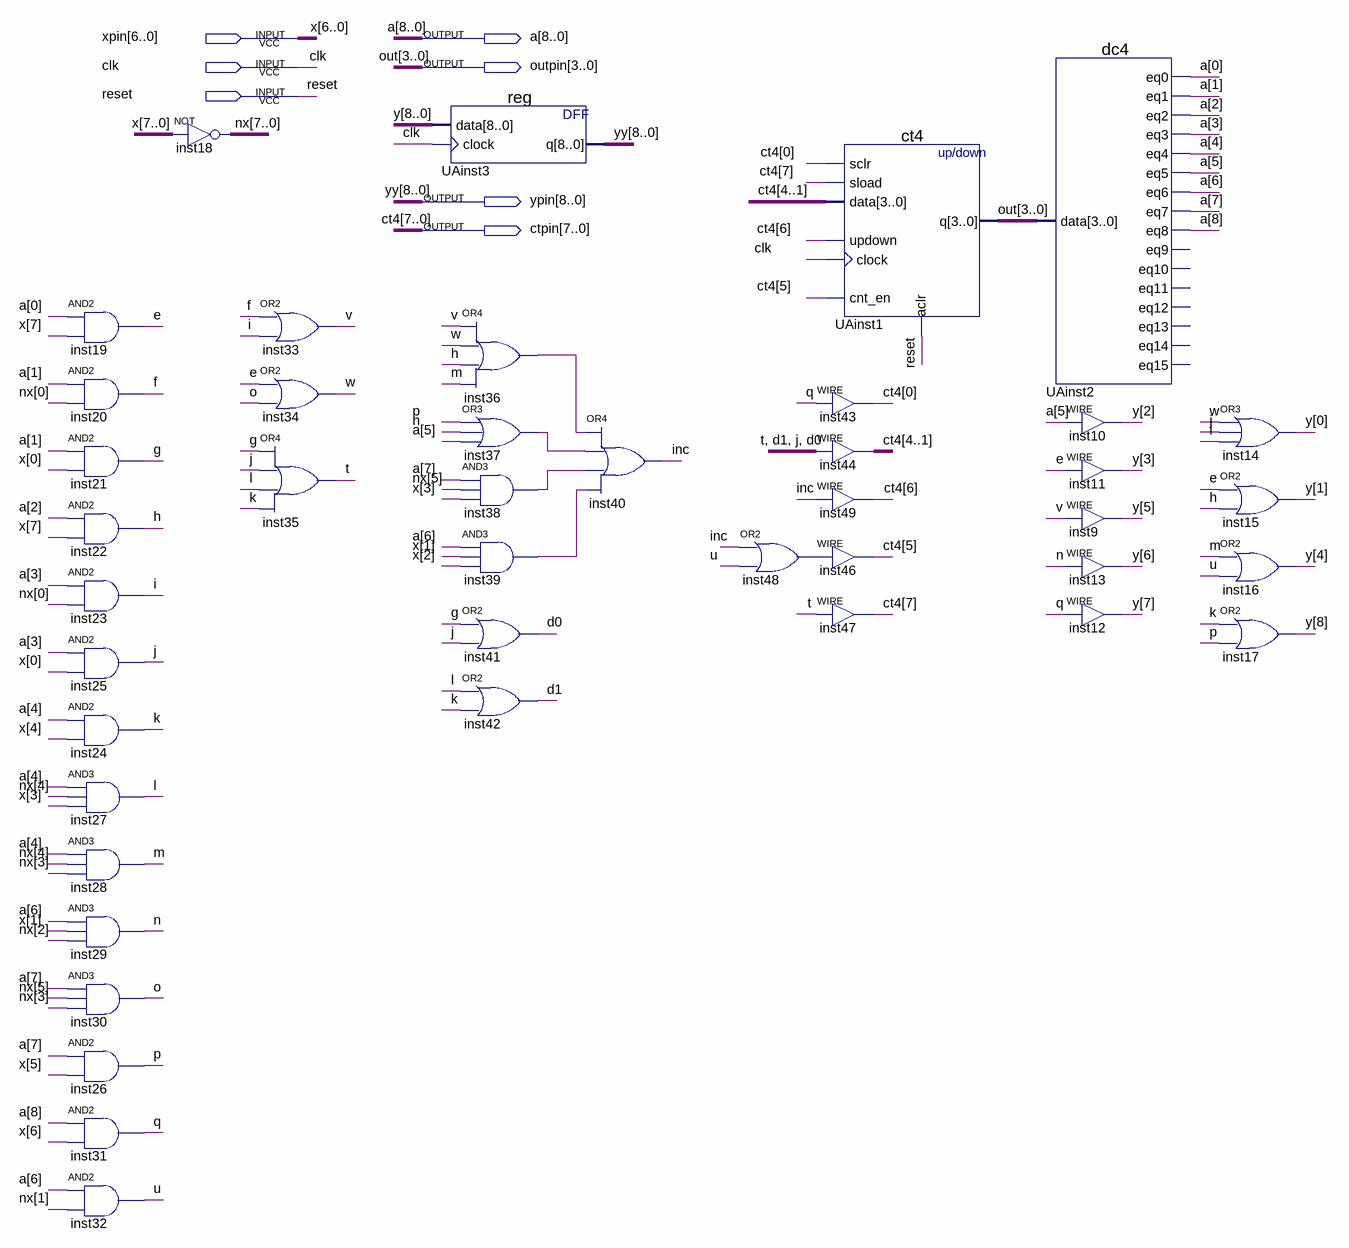
[diagram p0: schematic sheet]
// Quartus schematic UA.bdf as structural Verilog: 43 symbols, 7 pins
module UA (
  input  [6:0] xpin,
  input  clk,
  input  reset,
  output [8:0] a,
  output [3:0] outpin,
  output [8:0] ypin,
  output [7:0] ctpin
);

  wire d0, d1, e, f, g, h, i, inc, inst36_out, inst37_out, inst38_out, inst39_out, inst48_out, j, k, l, m, n,
       o, p, q, t, u, v, w;
  wire [7:0] nx;
  wire [7:7] x;
  wire [8:0] y;

  and inst19 (e, a[0], x[7]);
  and inst20 (f, a[1], nx[0]);
  and inst21 (g, a[1], xpin[0]);
  and inst22 (h, a[2], x[7]);
  and inst23 (i, a[3], nx[0]);
  and inst25 (j, a[3], xpin[0]);
  and inst24 (k, a[4], xpin[4]);
  and inst27 (l, a[4], nx[4], xpin[3]);
  and inst28 (m, a[4], nx[4], nx[3]);
  and inst29 (n, a[6], xpin[1], nx[2]);
  and inst30 (o, a[7], nx[5], nx[3]);
  and inst26 (p, a[7], xpin[5]);
  and inst31 (q, a[8], xpin[6]);
  and inst32 (u, a[6], nx[1]);
  assign nx = ~{x[7], xpin};  // NOT inst18, 8 bits wide
  or inst33 (v, f, i);
  or inst34 (w, e, o);
  or inst35 (t, g, j, l, k);
  \reg  UAinst3 (.data(y), .clock(clk), .q(ypin));
  or inst36 (inst36_out, v, w, h, m);
  or inst37 (inst37_out, p, n, a[5]);
  and inst38 (inst38_out, a[7], nx[5], xpin[3]);
  and inst39 (inst39_out, a[6], xpin[1], xpin[2]);
  or inst41 (d0, g, j);
  or inst42 (d1, l, k);
  or inst40 (inc, inst36_out, inst37_out, inst38_out, inst39_out);
  or inst48 (inst48_out, inc, u);
  ct4 UAinst1 (
    .sclr(ctpin[0]), .sload(ctpin[7]), .data(ctpin[4:1]), .updown(ctpin[6]), .clock(clk), .cnt_en(ctpin[5]),
    .aclr(reset), .q(outpin));
  assign ctpin[0] = q;  // WIRE inst43
  assign ctpin[4:1] = {t, d1, j, d0};  // WIRE inst44
  assign ctpin[6] = inc;  // WIRE inst49
  assign ctpin[5] = inst48_out;  // WIRE inst46
  assign ctpin[7] = t;  // WIRE inst47
  dc4 UAinst2 (
    .data(outpin), .eq0(a[0]), .eq1(a[1]), .eq2(a[2]), .eq3(a[3]), .eq4(a[4]), .eq5(a[5]), .eq6(a[6]),
    .eq7(a[7]), .eq8(a[8]));  // open: eq9, eq10, eq11, eq12, eq13, eq14, eq15
  assign y[2] = a[5];  // WIRE inst10
  assign y[3] = e;  // WIRE inst11
  assign y[5] = v;  // WIRE inst9
  assign y[6] = n;  // WIRE inst13
  assign y[7] = q;  // WIRE inst12
  or inst14 (y[0], w, j, l);
  or inst15 (y[1], e, h);
  or inst16 (y[4], m, u);
  or inst17 (y[8], k, p);

  // Other names for the same wires on the sheet: ct4[7:0] = ctpin; out[3:0] = outpin; x[6:0] = xpin; yy[8:0] = ypin
endmodule
